# EAGLE design untitled (EAGLE 5.11)
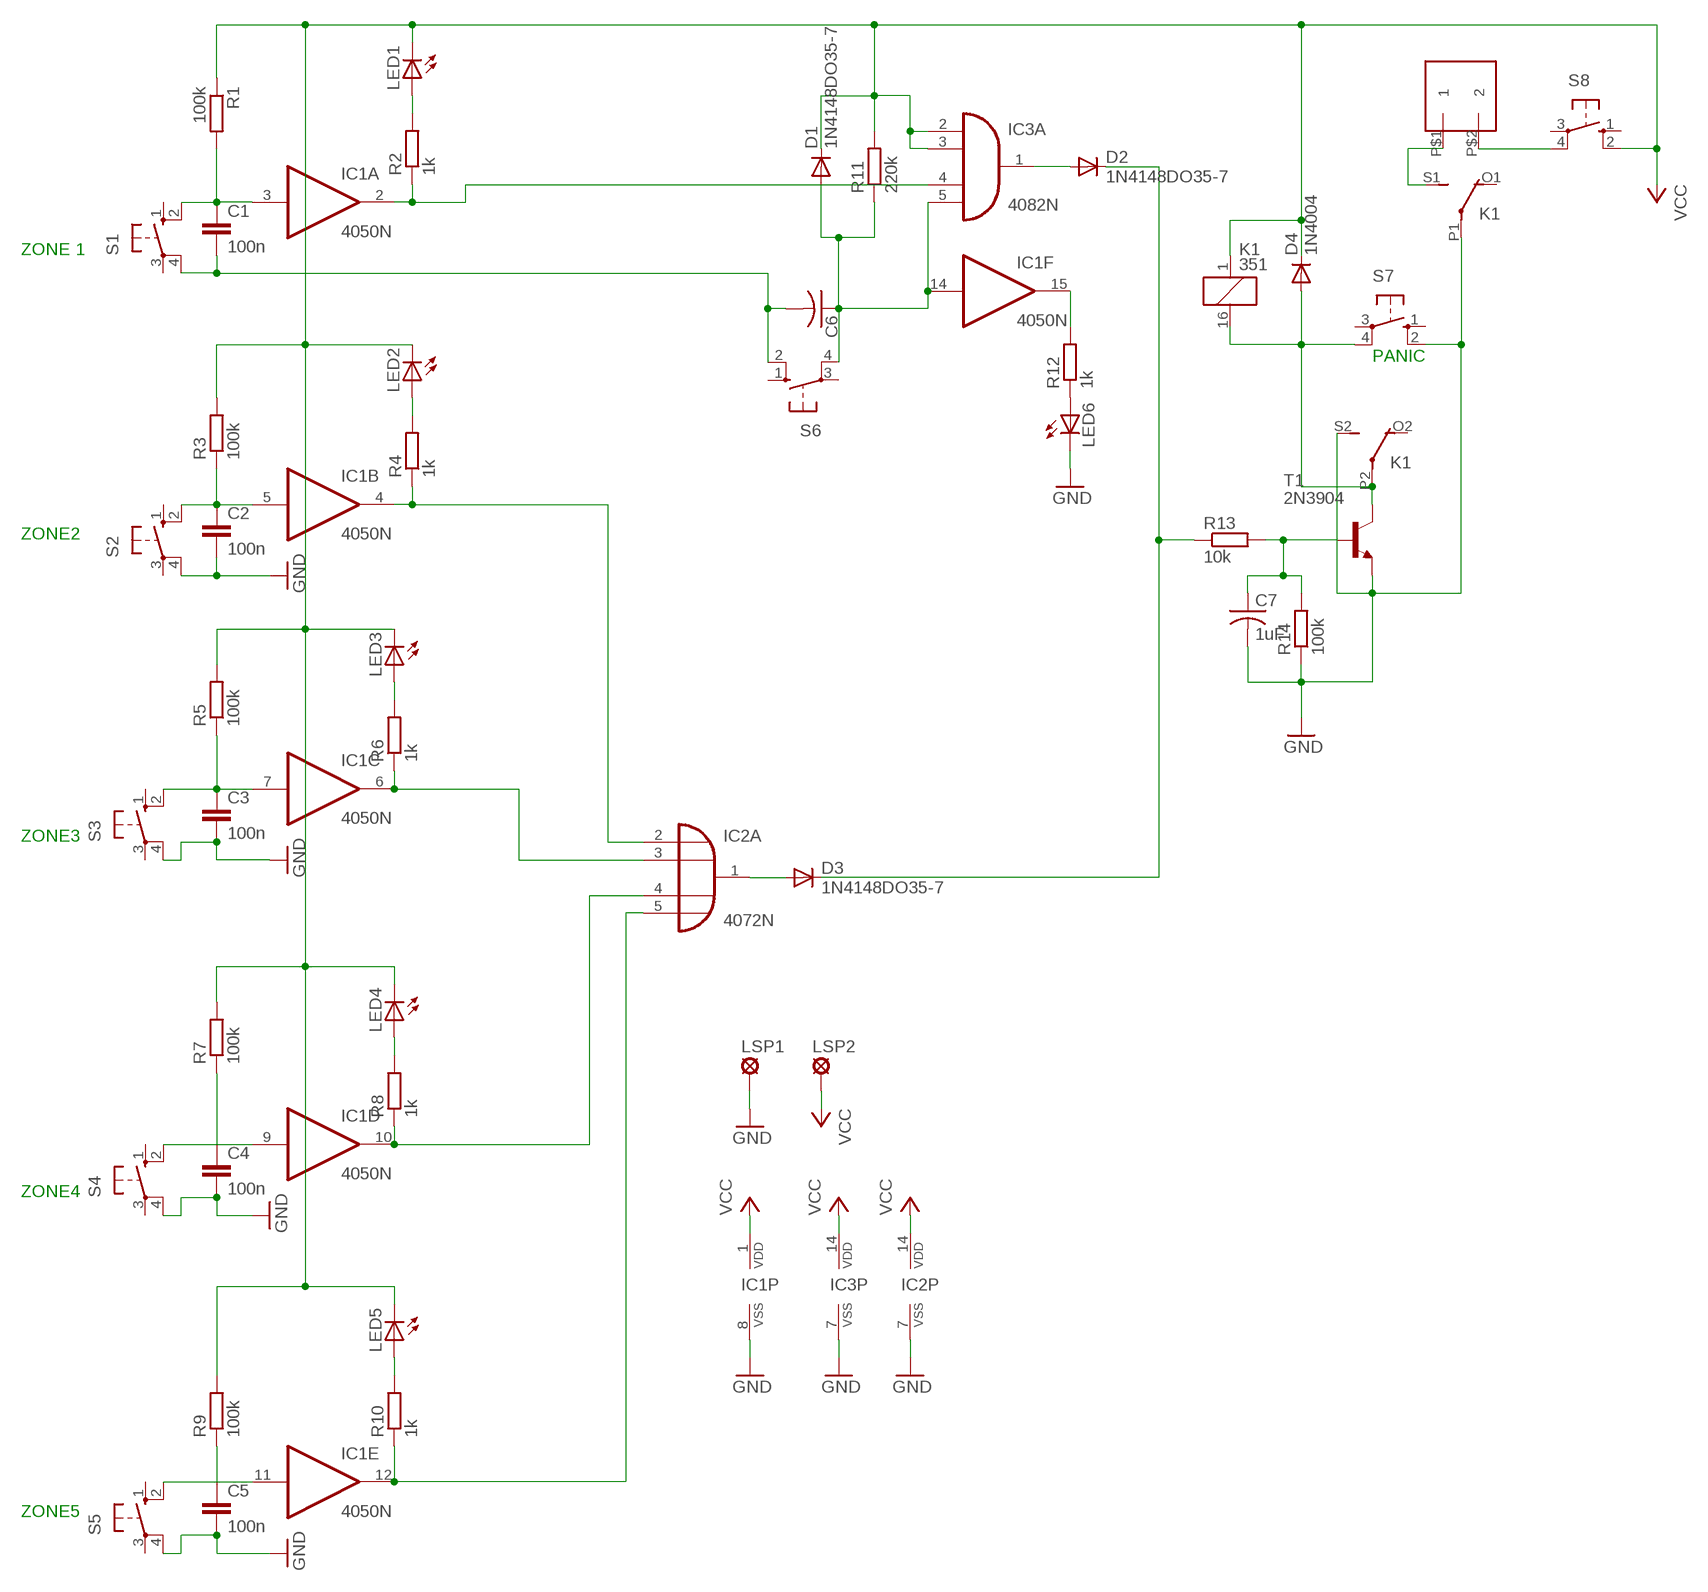
[diagram p0: schematic, sheet 1]

## Parts
BORNE_2_PCI1  BORNE_2_PCI  [BORNE_2_PCI]
C1  100n  C-EU025-024X044  [C025-024X044]
C2  100n  C-EU025-024X044  [C025-024X044]
C3  100n  C-EU025-024X044  [C025-024X044]
C4  100n  C-EU025-024X044  [C025-024X044]
C5  100n  C-EU025-024X044  [C025-024X044]
C6  C-US025-024X044  [C025-024X044]
C7  1uF  C-US025-024X044  [C025-024X044]
D1  1N4148DO35-7  [DO35-7]
D2  1N4148DO35-7  [DO35-7]
D3  1N4148DO35-7  [DO35-7]
D4  1N4004  [DO41-10]
IC1  4050N  [DIL16]
IC2  4072N  [DIL14]
IC3  4082N  [DIL14]
K1  351  [351]
LED1  LED5MM  [LED5MM]
LED2  LED5MM  [LED5MM]
LED3  LED5MM  [LED5MM]
LED4  LED5MM  [LED5MM]
LED5  LED5MM  [LED5MM]
LED6  LED5MM  [LED5MM]
LSP1  LSP11  [LSP11]
LSP2  LSP11  [LSP11]
R1  100k  R-EU_0204/7  [0204/7]
R2  1k  R-EU_0204/7  [0204/7]
R3  100k  R-EU_0204/7  [0204/7]
R4  1k  R-EU_0204/7  [0204/7]
R5  100k  R-EU_0204/7  [0204/7]
R6  1k  R-EU_0204/7  [0204/7]
R7  100k  R-EU_0204/7  [0204/7]
R8  1k  R-EU_0204/7  [0204/7]
R9  100k  R-EU_0204/7  [0204/7]
R10  1k  R-EU_0204/7  [0204/7]
R11  220k  R-EU_0204/7  [0204/7]
R12  1k  R-EU_0204/7  [0204/7]
R13  10k  R-EU_0204/7  [0204/7]
R14  100k  R-EU_0204/7  [0204/7]
S1  10-XX  [B3F-10XX]
S2  10-XX  [B3F-10XX]
S3  10-XX  [B3F-10XX]
S4  10-XX  [B3F-10XX]
S5  10-XX  [B3F-10XX]
S6  10-XX  [B3F-10XX]
S7  10-XX  [B3F-10XX]
S8  10-XX  [B3F-10XX]
T1  2N3904  [TO92]

## Nets
GND: C2.2 C3.2 C4.2 C5.2 C7.2 IC1.8(P:VSS) IC2.7(P:VSS) IC3.7(P:VSS) K1.P1(2:P) K1.S2(3:S) LED6.K(C) LSP1.MP R14.1 S2.4(P1) S3.4(P1) S4.4(P1) S5.4(P1) S7.2(S1) T1.3(E)
N$1: C1.1 IC1.3(A:I) R1.2 S1.2(S1)
N$2: D2.A IC3.1(A:O)
N$4: LED1.A R2.2
N$5: IC1.2(A:O) IC3.4(A:I2) R2.1
N$6: C2.1 IC1.5(B:I) R3.1 S2.2(S1)
N$7: C6.1 D1.A IC1.14(F:I) IC3.5(A:I3) R11.1 S6.4(P1)
N$8: IC1.4(B:O) IC2.2(A:I0) R4.1
N$9: LED2.A R4.2
N$10: R13.2 T1.2(B)
N$11: C3.1 IC1.7(C:I) R5.1 S3.2(S1)
N$12: IC1.6(C:O) IC2.3(A:I1) R6.1
N$13: LED3.A R6.2
N$14: D3.A IC2.1(A:O)
N$15: C4.1 IC1.9(D:I) R7.1 S4.2(S1)
N$16: D2.C D3.C R13.1
N$17: LED4.A R8.2
N$18: IC1.10(D:O) IC2.4(A:I2) R8.1
N$19: BORNE_2_PCI1.P$1 K1.S1(2:S)
N$20: C5.1 IC1.11(E:I) R9.1 S5.2(S1)
N$21: BORNE_2_PCI1.P$2 S8.4(P1)
N$22: C7.1 R14.2
N$23: LED5.A R10.2
N$24: IC1.12(E:O) IC2.5(A:I3) R10.1
N$25: LED6.A R12.1
N$26: IC1.15(F:O) R12.2
N$27: C1.2 C6.2 S1.4(P1) S6.2(S1)
N$28: D4.A K1.16 K1.P2(3:P) S7.4(P1) T1.1(C)
VCC: D1.C D4.C IC1.1(P:VDD) IC2.14(P:VDD) IC3.2(A:I0) IC3.3(A:I1) IC3.14(P:VDD) K1.1 LED1.K(C) LED2.K(C) LED3.K(C) LED4.K(C) LED5.K(C) LSP2.MP R1.1 R3.2 R5.2 R7.2 R9.2 R11.2 S8.2(S1)
Unconnected: IC2.9(B:I0) IC2.10(B:I1) IC2.11(B:I2) IC2.12(B:I3) IC2.13(B:O) IC3.9(B:I0) IC3.10(B:I1) IC3.11(B:I2) IC3.12(B:I3) IC3.13(B:O) K1.O1(2:O) K1.O2(3:O) S1.1(S) S1.3(P) S2.1(S) S2.3(P) S3.1(S) S3.3(P) S4.1(S) S4.3(P) S5.1(S) S5.3(P) S6.1(S) S6.3(P) S7.1(S) S7.3(P) S8.1(S) S8.3(P)

## Notes on the sheet
- ZONE 1
- PANIC
- ZONE2
- ZONE3
- ZONE4
- ZONE5

## Library data of the parts
BORNE_2_PCI1 = BORNE_2_PCI:BORNE_2_PCI
C1-C5 = rcl:C-EU: CAPACITOR, European symbol
C6 C7 = rcl:C-US: CAPACITOR, American symbol
D1-D3 = diode:1N4148: DIODE high speed (Philips)
D4 = diode:1N4004: DIODE general purpose rectifier, 1 A
IC1 = 40xx:4050: Hex non-inverting BUFFER
IC2 = 40xx:4072: Dual 4-input OR
IC3 = 40xx:4082: Dual 4-input AND
K1 = relay:351: RELAY 2 x switch, Omron; OC_FARNELL: unknown; OC_NEWARK: unknown
LED1-LED6 = led:LED: LED OSRAM: - CHIPLED LG R971, LG N971, LY N971, LG Q971, LY Q971, LO R971, LY R971 LH N974, LH R974 LS Q976, LO Q976, LY Q976 LO Q996 - Hyper CHIPLED LW Q18S LB Q993, LB Q99A, LB R99A - SideLED LS A670, LO A670, LY A670, LG A670, LP A670 LB A673, LV A673, LT A673, LW A673 LH A674 LY A675 LS A676, LA A676, LO A676, LY A676, LW A676 LS A679, LY A679, LG A679 - Hyper Micro SIDELED® LS Y876, LA Y876, LO Y876, LY Y876 LT Y87S - SmartLED LW L88C, LW L88S LB L89C, LB L89S, LG L890 LS L89K, LO L89K, LY L89K LS L896, LA L896, LO L896, LY L896 - TOPLED LS T670, LO T670, LY T670, LG T670, LP T670 LSG T670, LSP T670, LSY T670, LOP T670, LYG T670 LG T671, LOG T671, LSG T671 LB T673, LV T673, LT T673, LW T673 LH T674 LS T676, LA T676, LO T676, LY T676, LB T676, LH T676, LSB T676, LW T676 LB T67C, LV T67C, LT T67C, LS T67K, LO T67K, LY T67K, LW E67C LS E67B, LA E67B, LO E67B, LY E67B, LB E67C, LV E67C, LT E67C LW T67C LS T679, LY T679, LG T679 LS T770, LO T770, LY T770, LG T770, LP T770 LB T773, LV T773, LT T773, LW T773 LH T774 LS E675, LA E675, LY E675, LS T675 LS T776, LA T776, LO T776, LY T776, LB T776 LHGB T686 LT T68C, LB T68C - Hyper Mini TOPLED® LB M676 - Mini TOPLED Santana® LG M470 LS M47K, LO M47K, LY M47K Source: http://www.osram.convergy.de LUXEON: - LUMILED® LXK2-PW12-R00, LXK2-PW12-S00, LXK2-PW14-U00, LXK2-PW14-V00 LXK2-PM12-R00, LXK2-PM12-S00, LXK2-PM14-U00 LXK2-PE12-Q00, LXK2-PE12-R00, LXK2-PE12-S00, LXK2-PE14-T00, LXK2-PE14-U00 LXK2-PB12-K00, LXK2-PB12-L00, LXK2-PB12-M00, LXK2-PB14-N00, LXK2-PB14-P00, LXK2-PB14-Q00 LXK2-PR12-L00, LXK2-PR12-M00, LXK2-PR14-Q00, LXK2-PR14-R00 LXK2-PD12-Q00, LXK2-PD12-R00, LXK2-PD12-S00 LXK2-PH12-R00, LXK2-PH12-S00 LXK2-PL12-P00, LXK2-PL12-Q00, LXK2-PL12-R00 Source: www.luxeon.com KINGBRIGHT: KA-3528ASYC Source: www.kingbright.com
LSP1 LSP2 = solpad:LSP11: SOLDER PAD drill 1.1 mm
R1-R14 = rcl:R-EU_: RESISTOR, European symbol
S1-S8 = switch-omron:10-XX: OMRON SWITCH; MPN: B3F-1000; OC_FARNELL: 176432; OC_NEWARK: 36M3542
T1 = transistor:2N3904: NPN TRANSISTOR

## Board
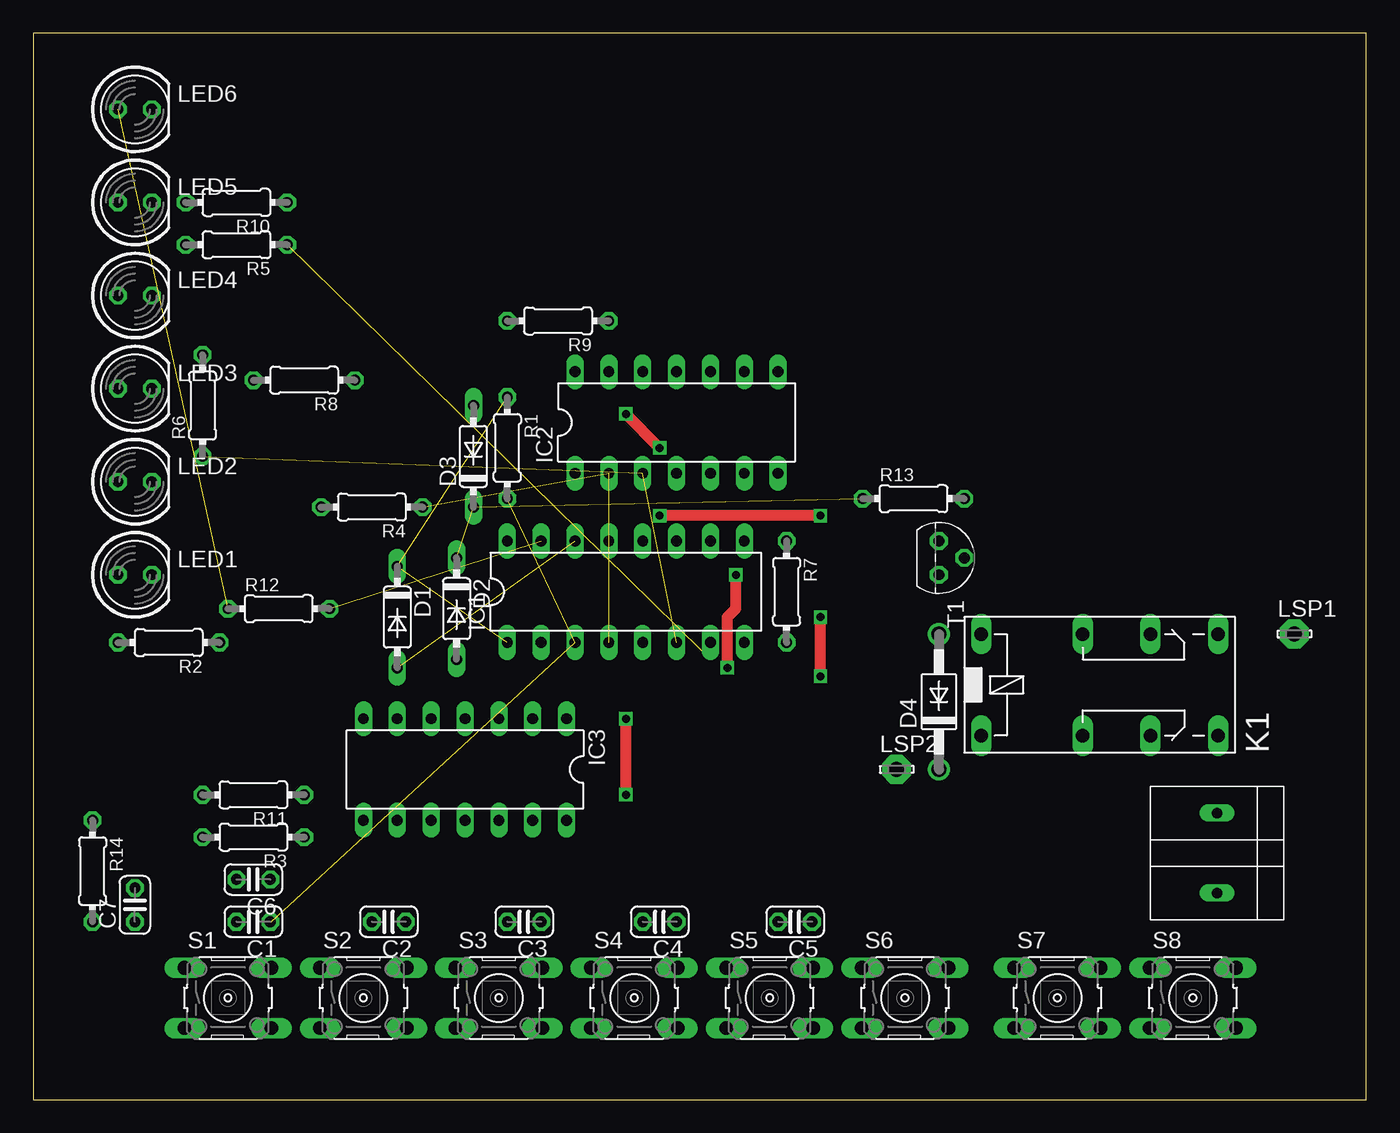
[diagram p1: board, top side]
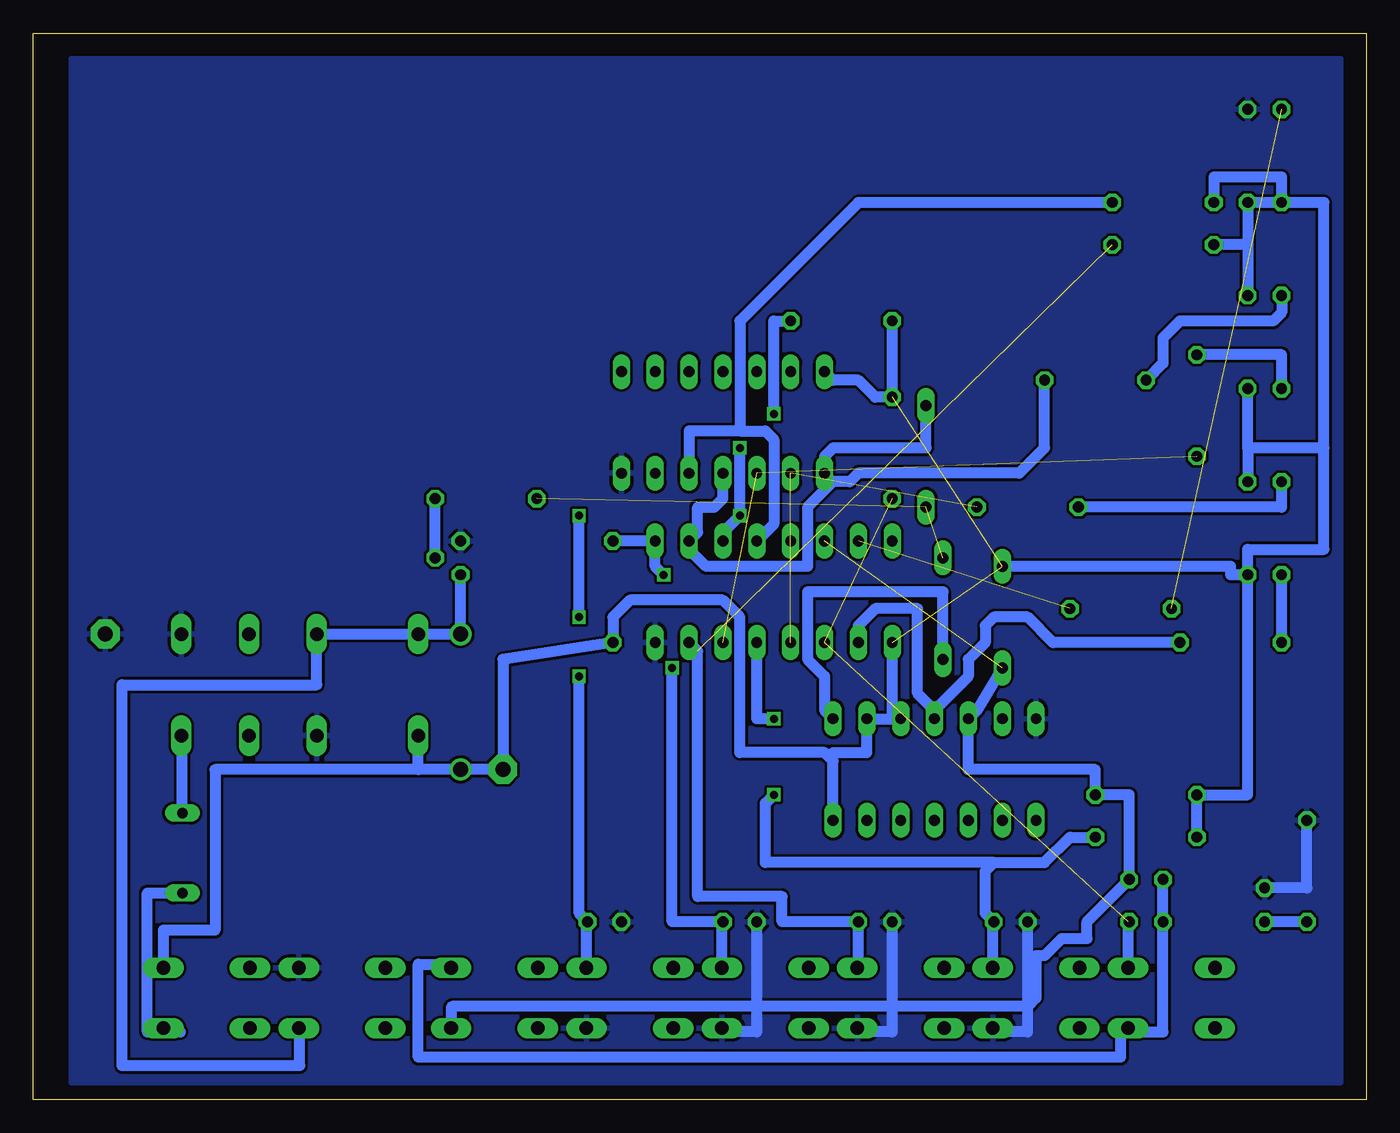
[diagram p2: board, bottom side, seen from below]

Size 100 x 80 mm. Coordinates in mm from the lower left corner, seen from the top.
Outline: 0,0 100,0 100,80 0,80 0,0
Copper layers (1*16): Top 0.035mm / dielectric 1.5mm / Bottom 0.035mm
Design rules "default": minimum track width 10mil, minimum drill 24mil, track to track 8mil, track to pad 8mil, pad to pad 8mil, via to via 8mil, smd to smd 8mil, copper to edge 40mil, drill to drill 8mil, minimum pad ring 10mil, minimum via ring 8mil, stop-mask expansion 4mil, vias tented up to drill 0mil, thermal gap 10mil

### Footprints (pad centres in the part's own frame; a part is rotated, then mirrored left to right if it is on the bottom)
BORNE_2_PCI = drill 0.8 long: P$1 -3.08,-0.08; P$2 2.92,-0.08
C025-024X044 = drill 0.813 octagon: 1 -1.27,0; 2 1.27,0
DO35-7 = drill 0.813 long: A 3.81,0; C -3.81,0
DO41-10 = drill 1.118 round: A 5.08,0; C -5.08,0
DIL16 = drill 0.813 long: 1 -8.89,-3.81; 2 -6.35,-3.81; 3 -3.81,-3.81; 4 -1.27,-3.81; 5 1.27,-3.81; 6 3.81,-3.81; 7 6.35,-3.81; 8 8.89,-3.81; 9 8.89,3.81; 10 6.35,3.81; 11 3.81,3.81; 12 1.27,3.81; 13 -1.27,3.81; 14 -3.81,3.81; 15 -6.35,3.81; 16 -8.89,3.81
DIL14 = drill 0.813 long: 1 -7.62,-3.81; 2 -5.08,-3.81; 3 -2.54,-3.81; 4 0,-3.81; 5 2.54,-3.81; 6 5.08,-3.81; 7 7.62,-3.81; 8 7.62,3.81; 9 5.08,3.81; 10 2.54,3.81; 11 0,3.81; 12 -2.54,3.81; 13 -5.08,3.81; 14 -7.62,3.81
351 = drill 1.016 long: 1 -3.81,-3.81; 16 -3.81,3.81; O1 8.89,-3.81; O2 8.89,3.81; P1 3.81,-3.81; P2 3.81,3.81; S1 13.97,-3.81; S2 13.97,3.81
LED5MM = drill 0.813 octagon: A -1.27,0; K 1.27,0
LSP11 = drill 1.118 pad 2.159 octagon: MP 0,0
0204/7 = drill 0.813 octagon: 1 -3.81,0; 2 3.81,0
B3F-10XX = drill 1.016 long: 1 -3.251,2.261; 2 3.251,2.261; 3 -3.251,-2.261; 4 3.251,-2.261
TO92 = drill 0.813 octagon: 1 1.27,0; 2 0,1.905; 3 -1.27,0

### Placement (x,y rotation side)
BORNE_2_PCI1  88.9,18.41 270 top
C1  16.51,13.34 180 top
C2  26.67,13.34 180 top
C3  36.83,13.34 180 top
C4  46.99,13.34 180 top
C5  57.15,13.34 180 top
C6  16.51,16.51 180 top
C7  7.62,14.61 90 top
D1  27.3,36.2 270 top
D2  31.75,36.83 270 top
D3  33.02,48.26 90 top
D4  67.94,29.84 90 top
IC1  44.45,38.1 0 top
IC2  48.26,50.8 0 top
IC3  32.38,24.77 180 top
K1  74.93,31.11 0 top
LED1  7.62,39.37 0 top
LED2  7.62,46.35 0 top
LED3  7.62,53.34 0 top
LED4  7.62,60.33 0 top
LED5  7.62,67.31 0 top
LED6  7.62,74.3 0 top
LSP1  94.61,34.92 0 top
LSP2  64.77,24.77 0 top
R1  35.56,48.9 270 top
R2  10.16,34.29 180 top
R3  16.51,19.68 180 top
R4  25.4,44.45 180 top
R5  15.24,64.14 180 top
R6  12.7,52.07 90 top
R7  56.52,38.1 270 top
R8  20.32,53.98 180 top
R9  39.37,58.42 180 top
R10  15.24,67.31 180 top
R11  16.51,22.86 180 top
R12  18.41,36.83 0 top
R13  66.04,45.09 0 top
R14  4.45,17.14 270 top
S1  14.61,7.62 0 top
S2  24.77,7.62 0 top
S3  34.92,7.62 0 top
S4  45.09,7.62 0 top
S5  55.24,7.62 0 top
S6  65.41,7.62 0 top
S7  76.83,7.62 0 top
S8  87,7.62 0 top
T1  67.94,40.64 270 top

### Tracks (layer width: path | path; a pad name or v marks a point on that pad's centre or on a via)
GND
  Bottom 0.813: R14.1 4.45,15.88 C7.2 | C2.2 25.4,5.08 28.02,5.08 S2.4 | C3.2 35.56,5.08 38.18,5.08 S3.4 | C4.2 45.72,5.08 48.34,5.08 S4.4
  pour Bottom: 2.54,78.11 97.16,78.11 97.16,76.83 97.16,1.27 1.91,1.27 1.91,8.26 1.91,78.11
N$1  (2 unrouted)
  Bottom 0.813: C1.1 17.86,13.34 S1.2
N$2
  Bottom 0.813: D2.A 31.75,38.1 41.91,38.1 41.91,33.02 40.64,31.75 40.64,29.21 IC3.1
N$4
  Bottom 0.813: R2.2 LED1.A
N$5
  Bottom 0.813: 32.38,29.21 IC3.4 | 32.38,29.21 33.66,30.48 33.66,36.83 36.83,36.83 38.1,35.56 IC1.2 | R2.1 23.5,34.29 25.4,36.2 27.94,36.2 28.57,35.56 28.57,34.29 29.84,33.02 29.84,31.75 32.38,29.21
N$6  (via drill 0.6)
  Top 0.813: v44.45,22.86 v44.45,28.57
  Bottom 0.813: S2.2 28.02,13.34 C2.1 28.57,13.97 28.57,17.14 27.94,17.78 | R3.1 22.23,19.68 24.13,17.78 27.94,17.78 | 27.94,17.78 45.09,17.78 45.09,22.23 v44.45,22.86 | v44.45,28.57 45.72,28.57 IC1.5
N$7  (1 unrouted)
  Bottom 0.813: D1.A 29.21,29.21 IC3.5 29.84,24.77 20.32,24.77 R11.1 17.78,22.86 C6.1 20.95,13.34 20.95,12.06 22.86,12.06 24.13,10.79 24.77,10.79 24.77,7.62 25.4,6.99 68.58,6.99 68.66,6.91 S6.4
N$8  (2 unrouted)
N$9
  Bottom 0.813: LED2.A 6.35,44.45 R4.2
N$10
  Bottom 0.813: T1.2 R13.2
N$11  (1 unrouted)
  Bottom 0.813: S3.2 38.1,9.88 C3.1 43.81,13.34 43.81,15.24 50.16,15.24 50.16,33.66 IC1.7
N$12  (2 unrouted)
N$13
  Bottom 0.813: LED3.A 6.35,55.88 R6.2
N$14
  Bottom 0.813: IC2.1 40.64,48.26 40.01,48.9 33.02,48.9 D3.A
N$15  (via drill 0.6)
  Top 0.813: v52.7,39.37 52.7,36.83 52.07,36.2 v52.07,32.38
  Bottom 0.813: S4.2 48.34,13.34 C4.1 52.07,13.34 v52.07,32.38 | R7.1 IC1.9 53.34,40.01 v52.7,39.37
N$16  (2 unrouted)
N$17
  Bottom 0.813: LED4.A 6.35,59.05 6.99,58.42 13.97,58.42 15.24,57.15 15.24,55.24 R8.2
N$18
  Bottom 0.813: IC2.4 48.26,45.09 48.9,44.45 50.16,44.45 50.16,42.55 IC1.10 50.8,41.27 49.53,40.01 41.91,40.01 41.91,44.45 40.01,46.35 38.73,46.35 38.1,46.99 26.04,46.99 24.13,48.9 R8.1
N$19
  Bottom 0.813: K1.S1 88.82,27.3 BORNE_2_PCI1.P$1
N$20  (via drill 0.6)
  Top 0.813: v59.05,43.81 v46.99,43.81 | v59.05,31.75 v59.05,36.2 | v46.99,48.9 v44.45,51.44
  Bottom 0.813: S5.2 58.5,13.34 C5.1 59.05,13.97 v59.05,31.75 | IC1.11 48.26,42.55 v46.99,43.81 v46.99,48.9 | v59.05,36.2 v59.05,43.81 | v44.45,51.44 44.45,58.42 R9.1
N$21
  Bottom 0.813: BORNE_2_PCI1.P$2 91.44,15.49 91.44,5.08 88.98,5.08 S8.4
N$22
  Bottom 0.813: R14.2 C7.1
N$23
  Bottom 0.813: LED5.A 6.35,69.22 11.43,69.22 R10.2
N$24
  Bottom 0.813: IC2.5 50.8,50.16 46.99,50.16 | 46.99,50.16 45.09,50.16 44.45,49.53 44.45,43.18 IC1.12 | R10.1 38.1,67.31 46.99,58.42 46.99,50.16
N$25  (1 unrouted)
N$26  (1 unrouted)
N$27
  Bottom 0.813: C6.2 C1.2 15.24,5.08 17.86,5.08 S1.4 18.41,5.36 18.41,3.17 71.12,3.17 71.12,10.16 68.66,10.16 S6.2
N$28
  Bottom 0.813: S7.4 80.01,5.36 80.01,2.54 93.34,2.54 93.34,31.11 78.74,31.11 K1.P2 K1.16 D4.A T1.1
VCC  (2 unrouted)
  Bottom 0.813: 71.12,24.77 D4.C LSP2.MP 64.77,33.02 R7.2 56.52,36.2 55.24,37.47 48.26,37.47 46.99,36.2 46.99,26.04 40.64,26.04 40.01,25.4 | 71.12,24.77 K1.1 | R3.2 R11.2 8.89,22.86 LED1.K | D1.C 10.16,40.01 10.16,39.37 LED1.K | 8.89,64.14 R5.2 | LED1.K 8.89,41.27 3.17,41.27 3.17,48.9 | 3.17,48.9 3.17,67.31 LED5.K 8.89,64.14 | 8.89,48.9 LED2.K | 3.17,48.9 8.89,48.9 | 8.89,48.9 LED3.K | 8.89,64.14 LED4.K | 71.12,24.77 86.36,24.77 86.36,12.7 90.25,12.7 S8.2 | R9.2 R1.1 36.83,52.7 38.1,53.98 40.01,53.98 IC2.14 | 35.56,28.57 IC3.2 37.47,26.04 40.01,26.04 40.01,25.4 | 35.56,28.57 IC3.3 | IC3.14 40.01,25.4 | 35.56,28.57 IC1.1